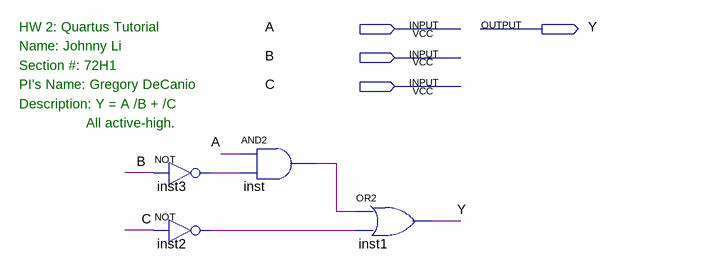
[diagram p0: schematic sheet]
// Quartus schematic lab1_ex.bdf as structural Verilog: 4 symbols, 4 pins
module lab1_ex (
  input  A,
  input  B,
  input  C,
  output Y
);

  wire inst2_out, inst3_out, inst_out;

  not inst3 (inst3_out, B);
  not inst2 (inst2_out, C);
  and inst (inst_out, A, inst3_out);
  or inst1 (Y, inst_out, inst2_out);

  // Notes on the sheet:
  //   HW 2: Quartus Tutorial
  //   Name: Johnny Li
  //   Section #: 72H1
  //   PI's Name: Gregory DeCanio 
  //   Description: Y = A /B + /C
  //   All active-high.
endmodule
